# EAGLE schematic schematic (EAGLE 9.1.1)
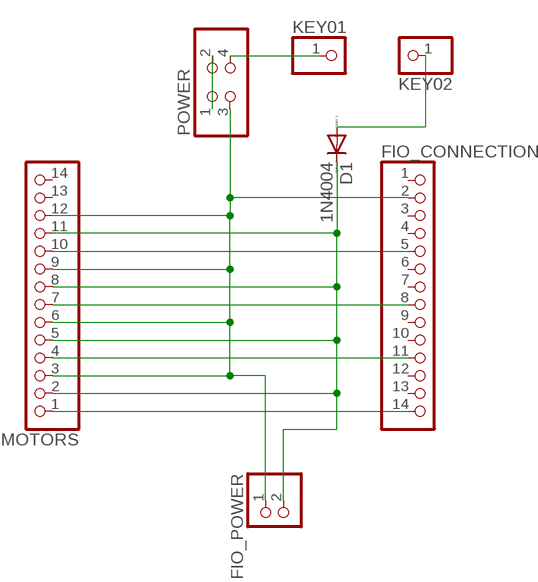
[diagram p0: schematic, sheet 1]

## Parts
D1  1N4004  [DO41-10]
FIO_CONNECTION  PINHD-1X14  [1X14]
FIO_POWER  PINHD-1X2  [1X02]
KEY01  PINHD-1X1  [1X01]
KEY02  PINHD-1X1  [1X01]
MOTORS  PINHD-1X14  [1X14]
POWER  PINHD-2X2  [2X02]

## Nets
GND: FIO_CONNECTION.2 FIO_POWER.1 MOTORS.3 MOTORS.6 MOTORS.9 MOTORS.12 POWER.3
N$1: POWER.1 POWER.2
N$2: KEY01.1 POWER.4
N$3: D1.A KEY02.1
N$5: FIO_CONNECTION.14 MOTORS.1
N$6: FIO_CONNECTION.11 MOTORS.4
N$7: FIO_CONNECTION.8 MOTORS.7
N$8: FIO_CONNECTION.5 MOTORS.10
VCC: D1.C FIO_POWER.2 MOTORS.2 MOTORS.5 MOTORS.8 MOTORS.11
Unconnected: FIO_CONNECTION.1 FIO_CONNECTION.3 FIO_CONNECTION.4 FIO_CONNECTION.6 FIO_CONNECTION.7 FIO_CONNECTION.9 FIO_CONNECTION.10 FIO_CONNECTION.12 FIO_CONNECTION.13 MOTORS.13 MOTORS.14

## Library data of the parts
D1 = diode:1N4004: DIODE general purpose rectifier, 1 A
FIO_CONNECTION MOTORS = pinhead:PINHD-1X14: PIN HEADER
FIO_POWER = pinhead:PINHD-1X2: PIN HEADER
KEY01 KEY02 = pinhead:PINHD-1X1: PIN HEADER
POWER = pinhead:PINHD-2X2: PIN HEADER